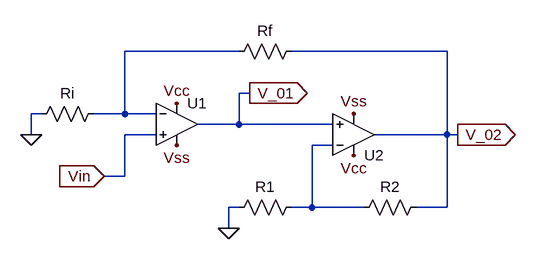
[diagram p0: schematic Esquema.asc]
Esquema.asc, the LTspice schematic file:
Version 4
SHEET 1 1652 680
WIRE 576 -320 400 -320
WIRE 896 -320 656 -320
WIRE 592 -256 576 -256
WIRE 272 -224 256 -224
WIRE 400 -224 400 -320
WIRE 400 -224 352 -224
WIRE 448 -224 400 -224
WIRE 576 -208 576 -256
WIRE 576 -208 512 -208
WIRE 720 -208 576 -208
WIRE 256 -192 256 -224
WIRE 448 -192 400 -192
WIRE 896 -192 896 -320
WIRE 896 -192 784 -192
WIRE 912 -192 896 -192
WIRE 720 -176 688 -176
WIRE 400 -128 400 -192
WIRE 400 -128 368 -128
WIRE 576 -80 560 -80
WIRE 688 -80 688 -176
WIRE 688 -80 656 -80
WIRE 768 -80 688 -80
WIRE 896 -80 896 -192
WIRE 896 -80 848 -80
WIRE 560 -48 560 -80
FLAG 560 -48 0
FLAG 480 -240 Vcc
FLAG 480 -176 Vss
FLAG 368 -128 Vin
IOPIN 368 -128 In
FLAG 912 -192 V_02
IOPIN 912 -192 Out
FLAG 752 -160 Vcc
FLAG 752 -224 Vss
FLAG 256 -192 0
FLAG 592 -256 V_01
IOPIN 592 -256 Out
SYMBOL OpAmps\\opamp2 480 -272 R0
WINDOW 3 16 96 Invisible 2
SYMATTR Value LM324
SYMATTR InstName U1
SYMBOL res 672 -96 R90
WINDOW 0 0 56 VBottom 2
WINDOW 3 32 56 VTop 2
SYMATTR InstName R1
SYMATTR Value ""
SYMBOL res 752 -64 R270
WINDOW 0 32 56 VTop 2
WINDOW 3 0 56 VBottom 2
SYMATTR InstName R2
SYMATTR Value ""
SYMBOL res 672 -336 R90
WINDOW 0 0 56 VBottom 2
WINDOW 3 32 56 VTop 2
SYMATTR InstName Rf
SYMATTR Value ""
SYMBOL res 256 -208 R270
WINDOW 0 32 56 VTop 2
WINDOW 3 0 56 VBottom 2
SYMATTR InstName Ri
SYMATTR Value ""
SYMBOL OpAmps\\opamp2 752 -128 M180
WINDOW 3 16 96 Invisible 2
SYMATTR Value LM324
SYMATTR InstName U2

The netlist it stands for:
* Esquema.asc
XU1 Vin N001 Vcc Vss V_01 LM324  ; pins In+ In- V+ V- OUT
R1 N002 0
R2 N002 V_02
Rf V_02 N001
Ri 0 N001
XU2 V_01 N002 Vcc Vss V_02 LM324  ; pins In+ In- V+ V- OUT
.backanno
.end